# EAGLE schematic PCB (EAGLE 9.2.0)
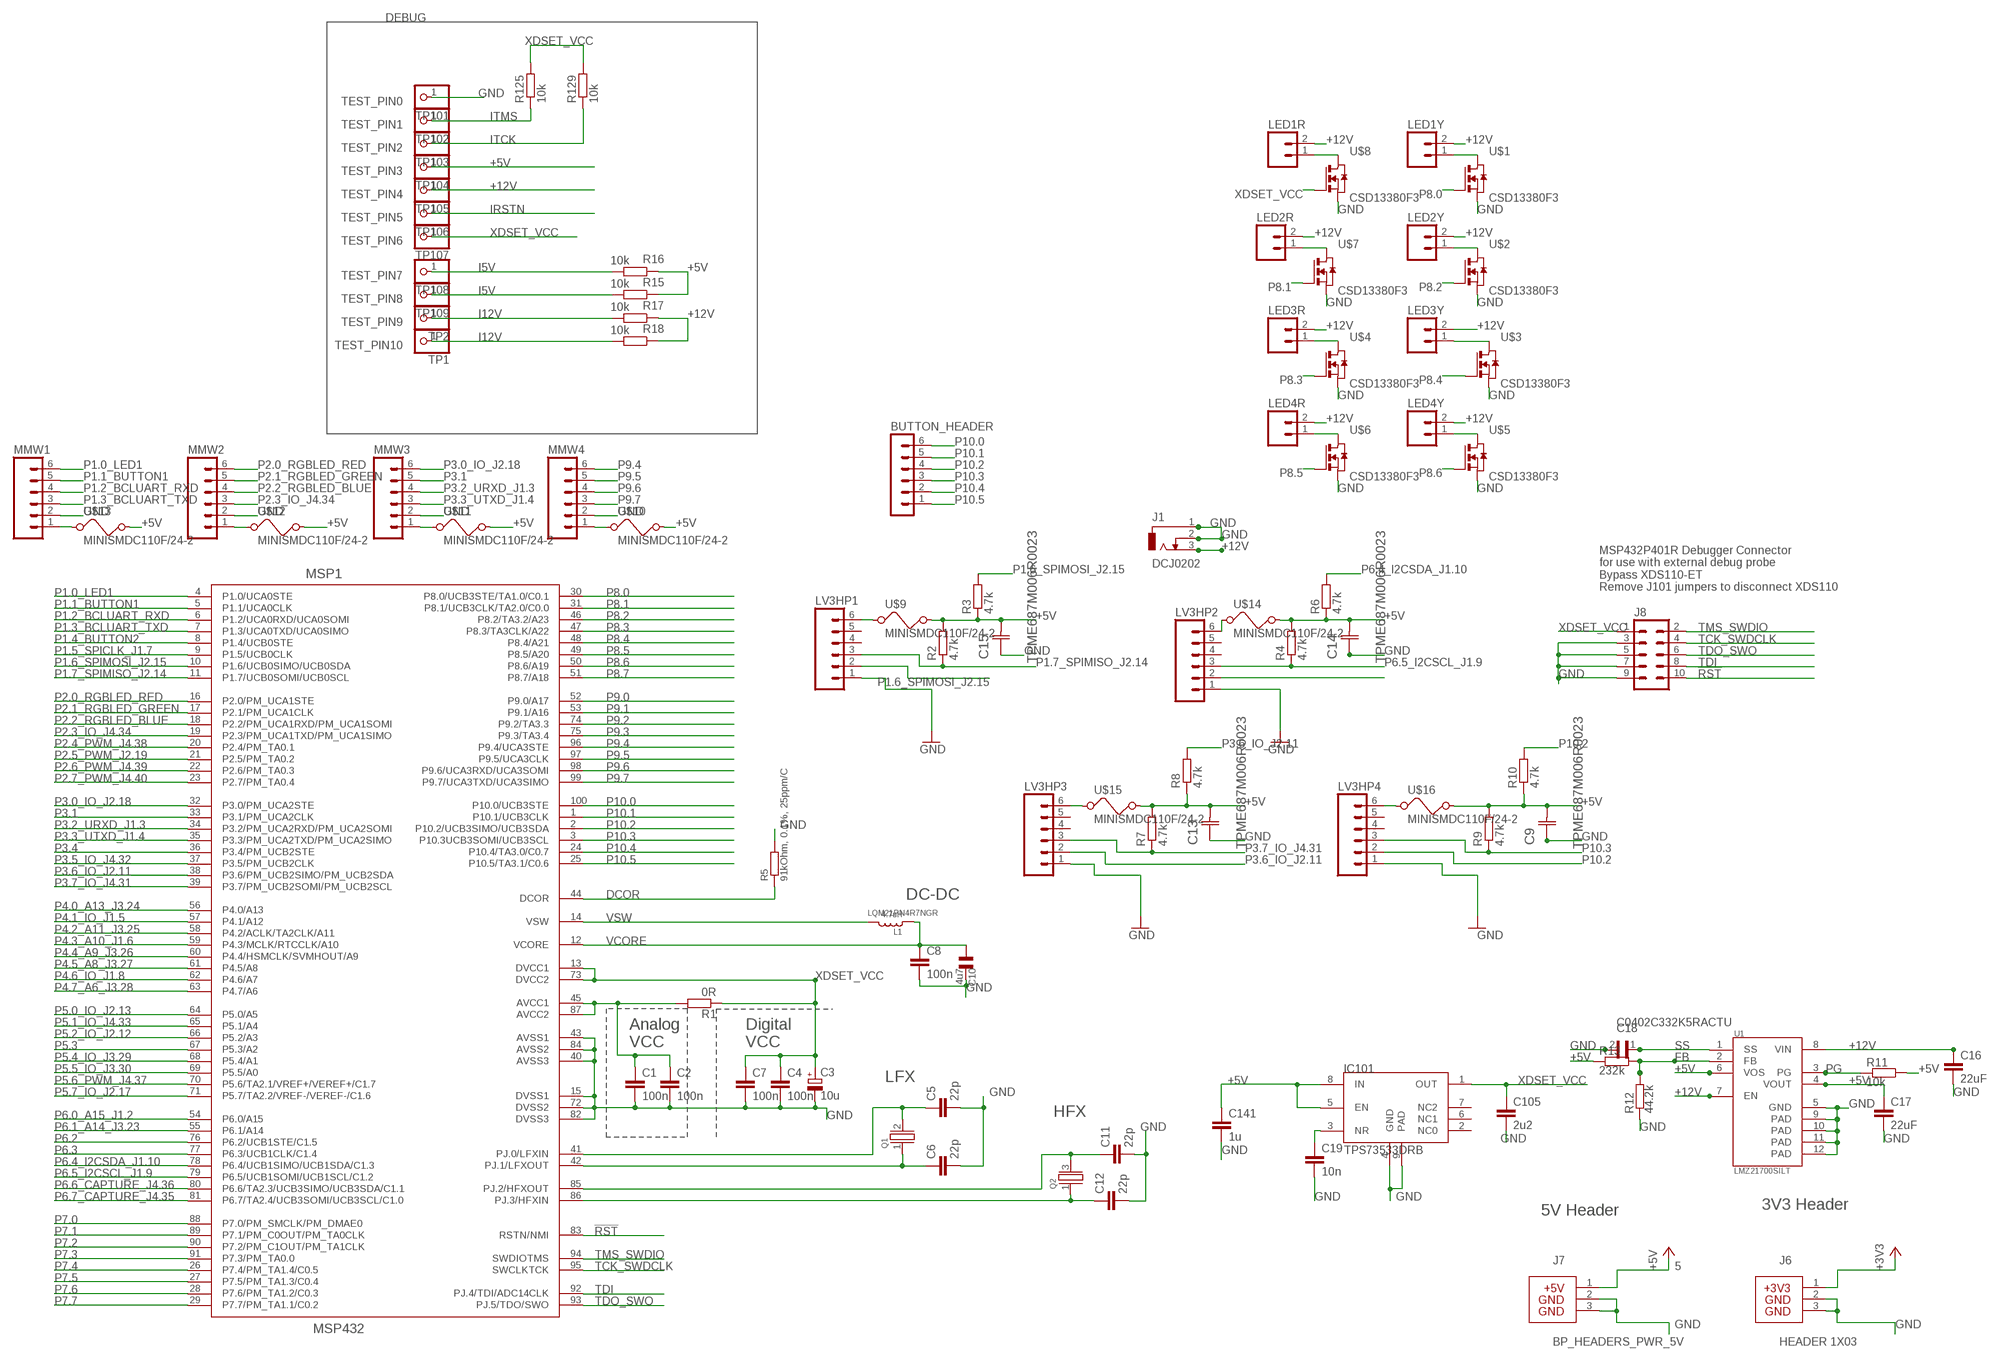
[diagram p0: schematic, sheet 1]

## Parts
BUTTON_HEADER  MA06-1  [MA06-1]
C1  100n  C-EUCM0402  [0402]
C2  100n  C-EUCM0402  [0402]
C3  10u  CPOL-EUA/3216-18R  [A/3216-18R]
C4  100n  C-EUCM0402  [0402]
C5  22p  C-EUCM0402  [0402]
C6  22p  C-EUCM0402  [0402]
C7  100n  C-EUCM0402  [0402]
C8  100n  C-EUCM0402  [0402]
C9  TPME687M006R0023  [CAPCP7343X430N]
C10  4u7  CSMD0805  [CSMD0805]
C11  22p  C-EUCM0402  [0402]
C12  22p  C-EUCM0402  [0402]
C13  TPME687M006R0023  [CAPCP7343X430N]
C14  TPME687M006R0023  [CAPCP7343X430N]
C15  TPME687M006R0023  [CAPCP7343X430N]
C16  22uF  22UF-0805-6.3V-20%  [0805]
C17  22uF  22UF-0805-6.3V-20%  [0805]
C18  C0402C332K5RACTU  [CAPC1005X55N]
C19  10n  C-EUC0603  [C0603]
C105  2u2  C-EUC0603  [C0603]
C141  1u  C-EUC0603  [C0603]
IC101  TPS73533DRB  TPS73633DRB  [SON8]
J1  DCJ0202  [DCJ0202]
J6  HEADER 1X03  BP_HEADERS_PWR_3V3100-TH  [3PIN_PWR_3V3]
J7  BP_HEADERS_PWR_5V  [3PIN_PWR_5V]
J8  DEBUG_ARM-10  [ARM-10]
L1  4.7uH  LQM2MP_G0  [0806]
LED1R  MA02  [02PA]
LED1Y  MA02  [02PA]
LED2R  MA02  [02PA]
LED2Y  MA02  [02PA]
LED3R  MA02  [02PA]
LED3Y  MA02  [02PA]
LED4R  MA02  [02PA]
LED4Y  MA02  [02PA]
LV3HP1  MA06  [06PA]
LV3HP2  MA06  [06PA]
LV3HP3  MA06  [06PA]
LV3HP4  MA06  [06PA]
MMW1  MA06  [06PA]
MMW2  MA06  [06PA]
MMW3  MA06  [06PA]
MMW4  MA06  [06PA]
MSP1  MSP432  [PZ100]
Q1  CRYSTALLF_GENERAL  [LF_XTAL]
Q2  CRYSTALEPSON_FA-238  [FA-238]
R1  0R  R-EU_RM0402  [0402]
R2  4.7k  R-EU_RM0402  [0402]
R3  4.7k  R-EU_RM0402  [0402]
R4  4.7k  R-EU_RM0402  [0402]
R5  91kOhm, 0.1%, 25ppm/C  R_0805  [0805]
R6  4.7k  R-EU_RM0402  [0402]
R7  4.7k  R-EU_RM0402  [0402]
R8  4.7k  R-EU_RM0402  [0402]
R9  4.7k  R-EU_RM0402  [0402]
R10  4.7k  R-EU_RM0402  [0402]
R11  10k  SMK  [SMK]
R12  44.2k  SMK  [SMK]
R13  232k  SMK  [SMK]
R15  10k  R-EU_RM0402  [0402]
R16  10k  R-EU_RM0402  [0402]
R17  10k  R-EU_RM0402  [0402]
R18  10k  R-EU_RM0402  [0402]
R125  10k  R-EU_RM0402  [0402]
R129  10k  R-EU_RM0402  [0402]
TP1  TEST_PIN10  PINHD-1X1  [1X01]
TP2  TEST_PIN9  PINHD-1X1  [1X01]
TP101  TEST_PIN0  PINHD-1X1  [1X01]
TP102  TEST_PIN1  PINHD-1X1  [1X01]
TP103  TEST_PIN2  PINHD-1X1  [1X01]
TP104  TEST_PIN3  PINHD-1X1  [1X01]
TP105  TEST_PIN4  PINHD-1X1  [1X01]
TP106  TEST_PIN5  PINHD-1X1  [1X01]
TP107  TEST_PIN6  PINHD-1X1  [1X01]
TP108  TEST_PIN7  PINHD-1X1  [1X01]
TP109  TEST_PIN8  PINHD-1X1  [1X01]
U1  LMZ21700SILT  [DFN350X350X175-10RN]
U$1  CSD13380F3  [FEMTO-LGA]
U$2  CSD13380F3  [FEMTO-LGA]
U$3  CSD13380F3  [FEMTO-LGA]
U$4  CSD13380F3  [FEMTO-LGA]
U$5  CSD13380F3  [FEMTO-LGA]
U$6  CSD13380F3  [FEMTO-LGA]
U$7  CSD13380F3  [FEMTO-LGA]
U$8  CSD13380F3  [FEMTO-LGA]
U$9  MINISMDC110F/24-2  [MINISMDC110]
U$10  MINISMDC110F/24-2  [MINISMDC110]
U$11  MINISMDC110F/24-2  [MINISMDC110]
U$12  MINISMDC110F/24-2  [MINISMDC110]
U$13  MINISMDC110F/24-2  [MINISMDC110]
U$14  MINISMDC110F/24-2  [MINISMDC110]
U$15  MINISMDC110F/24-2  [MINISMDC110]
U$16  MINISMDC110F/24-2  [MINISMDC110]

## Nets
5: J7.1 ; supply symbol labelled +5V
!RST: J8.10 MSP1.83(RSTN/NMI)
+3V3: J6.1
+5V: C9.2(C2) C13.2(C2) C14.2(C2) C15.2(C2) C17.1 C141.1 IC101.5(EN) IC101.8(IN) R2.2 R3.1 R4.2 R6.1 R7.2 R8.1 R9.2 R10.1 R11.1 R13.2 R15.1 R16.1 TP104.1 U1.4(VOUT) U1.6(VOS) U$9.P$2 U$10.P$2 U$11.P$2 U$12.P$2 U$13.P$2 U$14.P$2 U$15.P$2 U$16.P$2
+12V: C16.1 J1.3 LED1R.2 LED1Y.2 LED2R.2 LED2Y.2 LED3R.2 LED3Y.2 LED4R.2 LED4Y.2 R17.1 R18.1 TP105.1 U1.7(EN) U1.8(VIN)
DCOR: MSP1.44(DCOR) R5.1
FB: R12.1 R13.1 U1.2(FB)
GND: C1.2 C2.2 C3.- C4.2 C5.2 C6.2 C7.2 C8.2 C9.1(C1) C10.2 C11.2 C12.2 C13.1(C1) C14.1(C1) C15.1(C1) C16.2 C17.2 C18.2 C19.2 C105.2 C141.2 IC101.4(GND) IC101.9(PAD) J1.1 J1.2 J6.2 J6.3 J7.2 J7.3 J8.3 J8.5 J8.7 J8.9 LED1R.1 LED1Y.1 LED2R.1 LED2Y.1 LED3R.1 LED3Y.1 LED4Y.1 LV3HP1.1 LV3HP2.1 LV3HP3.1 LV3HP4.1 MMW1.2 MMW2.2 MMW3.2 MMW4.2 MSP1.15(DVSS1) MSP1.40(AVSS3) MSP1.43(AVSS1) MSP1.72(DVSS2) MSP1.82(DVSS3) MSP1.84(AVSS2) R5.2 R12.2 TP101.1 U$1.DRAIN(D) U$1.SOURCE(S) U$2.DRAIN(D) U$2.SOURCE(S) U$3.DRAIN(D) U$3.SOURCE(S) U$4.DRAIN(D) U$4.SOURCE(S) U$5.DRAIN(D) U$5.SOURCE(S) U$6.SOURCE(S) U$7.DRAIN(D) U$7.SOURCE(S) U$8.DRAIN(D) U$8.SOURCE(S)
I5V: R15.2 R16.2 TP108.1 TP109.1
I12V: R17.2 R18.2 TP1.1 TP2.1
IRSTN: TP106.1
ITCK: R129.1 TP103.1
ITMS: R125.1 TP102.1
N$1: LED4R.1 U$6.DRAIN(D)
N$3: LV3HP1.6 U$9.P$1
N$4: LV3HP2.6 U$14.P$1
N$5: LV3HP4.6 U$16.P$1
N$6: C1.1 C2.1 MSP1.45(AVCC1) MSP1.87(AVCC2) R1.2
N$7: LV3HP3.6 U$15.P$1
N$8: MMW1.1 U$13.P$1
N$9: MMW2.1 U$12.P$1
N$10: U1.5(GND) U1.9(PAD) U1.10(PAD) U1.11(PAD) U1.12(PAD)
N$11: C19.1 IC101.3(NR)
N$12: MMW3.1 U$11.P$1
N$14: LV3HP2.2
N$15: MMW4.1 U$10.P$1
N$34: C6.1 MSP1.42(PJ.1/LFXOUT) Q1.1
N$38: C5.1 MSP1.41(PJ.0/LFXIN) Q1.2
P1.0_LED1: MMW1.6 MSP1.4(P1.0/UCA0STE)
P1.1_BUTTON1: MMW1.5 MSP1.5(P1.1/UCA0CLK)
P1.2_BCLUART_RXD: MMW1.4 MSP1.6(P1.2/UCA0RXD/UCA0SOMI)
P1.3_BCLUART_TXD: MMW1.3 MSP1.7(P1.3/UCA0TXD/UCA0SIMO)
P1.4_BUTTON2: MSP1.8(P1.4/UCB0STE)
P1.5_SPICLK_J1.7: MSP1.9(P1.5/UCB0CLK)
P1.6_SPIMOSI_J2.15: LV3HP1.2 MSP1.10(P1.6/UCB0SIMO/UCB0SDA) R3.2
P1.7_SPIMISO_J2.14: LV3HP1.3 MSP1.11(P1.7/UCB0SOMI/UCB0SCL) R2.1
P2.0_RGBLED_RED: MMW2.6 MSP1.16(P2.0/PM_UCA1STE)
P2.1_RGBLED_GREEN: MMW2.5 MSP1.17(P2.1/PM_UCA1CLK)
P2.2_RGBLED_BLUE: MMW2.4 MSP1.18(P2.2/PM_UCA1RXD/PM_UCA1SOMI)
P2.3_IO_J4.34: MMW2.3 MSP1.19(P2.3/PM_UCA1TXD/PM_UCA1SIMO)
P2.4_PWM_J4.38: MSP1.20(P2.4/PM_TA0.1)
P2.5_PWM_J2.19: MSP1.21(P2.5/PM_TA0.2)
P2.6_PWM_J4.39: MSP1.22(P2.6/PM_TA0.3)
P2.7_PWM_J4.40: MSP1.23(P2.7/PM_TA0.4)
P3.0_IO_J2.18: MMW3.6 MSP1.32(P3.0/PM_UCA2STE)
P3.1: MMW3.5 MSP1.33(P3.1/PM_UCA2CLK)
P3.2_URXD_J1.3: MMW3.4 MSP1.34(P3.2/PM_UCA2RXD/PM_UCA2SOMI)
P3.3_UTXD_J1.4: MMW3.3 MSP1.35(P3.3/PM_UCA2TXD/PM_UCA2SIMO)
P3.4: MSP1.36(P3.4/PM_UCB2STE)
P3.5_IO_J4.32: MSP1.37(P3.5/PM_UCB2CLK)
P3.6_IO_J2.11: LV3HP3.2 MSP1.38(P3.6/PM_UCB2SIMO/PM_UCB2SDA) R8.2
P3.7_IO_J4.31: LV3HP3.3 MSP1.39(P3.7/PM_UCB2SOMI/PM_UCB2SCL) R7.1
P4.0_A13_J3.24: MSP1.56(P4.0/A13)
P4.1_IO_J1.5: MSP1.57(P4.1/A12)
P4.2_A11_J3.25: MSP1.58(P4.2/ACLK/TA2CLK/A11)
P4.3_A10_J1.6: MSP1.59(P4.3/MCLK/RTCCLK/A10)
P4.4_A9_J3.26: MSP1.60(P4.4/HSMCLK/SVMHOUT/A9)
P4.5_A8_J3.27: MSP1.61(P4.5/A8)
P4.6_IO_J1.8: MSP1.62(P4.6/A7)
P4.7_A6_J3.28: MSP1.63(P4.7/A6)
P5.0_IO_J2.13: MSP1.64(P5.0/A5)
P5.1_IO_J4.33: MSP1.65(P5.1/A4)
P5.2/XT2IN: C12.1 MSP1.86(PJ.3/HFXIN) Q2.1
P5.2_IO_J2.12: MSP1.66(P5.2/A3)
P5.3: MSP1.67(P5.3/A2)
P5.3/XT2OUT: C11.1 MSP1.85(PJ.2/HFXOUT) Q2.3
P5.4_IO_J3.29: MSP1.68(P5.4/A1)
P5.5_IO_J3.30: MSP1.69(P5.5/A0)
P5.6_PWM_J4.37: MSP1.70(P5.6/TA2.1/VREF+/VEREF+/C1.7)
P5.7_IO_J2.17: MSP1.71(P5.7/TA2.2/VREF-/VEREF-/C1.6)
P6.0_A15_J1.2: MSP1.54(P6.0/A15)
P6.1_A14_J3.23: MSP1.55(P6.1/A14)
P6.2: MSP1.76(P6.2/UCB1STE/C1.5)
P6.3: MSP1.77(P6.3/UCB1CLK/C1.4)
P6.4_I2CSDA_J1.10: MSP1.78(P6.4/UCB1SIMO/UCB1SDA/C1.3) R6.2
P6.5_I2CSCL_J1.9: LV3HP2.3 MSP1.79(P6.5/UCB1SOMI/UCB1SCL/C1.2) R4.1
P6.6_CAPTURE_J4.36: MSP1.80(P6.6/TA2.3/UCB3SIMO/UCB3SDA/C1.1)
P6.7_CAPTURE_J4.35: MSP1.81(P6.7/TA2.4/UCB3SOMI/UCB3SCL/C1.0)
P7.0: MSP1.88(P7.0/PM_SMCLK/PM_DMAE0)
P7.1: MSP1.89(P7.1/PM_C0OUT/PM_TA0CLK)
P7.2: MSP1.90(P7.2/PM_C1OUT/PM_TA1CLK)
P7.3: MSP1.91(P7.3/PM_TA0.0)
P7.4: MSP1.26(P7.4/PM_TA1.4/C0.5)
P7.5: MSP1.27(P7.5/PM_TA1.3/C0.4)
P7.6: MSP1.28(P7.6/PM_TA1.2/C0.3)
P7.7: MSP1.29(P7.7/PM_TA1.1/C0.2)
P8.0: MSP1.30(P8.0/UCB3STE/TA1.0/C0.1) U$1.GATE(G)
P8.1: MSP1.31(P8.1/UCB3CLK/TA2.0/C0.0) U$7.GATE(G)
P8.2: MSP1.46(P8.2/TA3.2/A23) U$2.GATE(G)
P8.3: MSP1.47(P8.3/TA3CLK/A22) U$4.GATE(G)
P8.4: MSP1.48(P8.4/A21) U$3.GATE(G)
P8.5: MSP1.49(P8.5/A20) U$6.GATE(G)
P8.6: MSP1.50(P8.6/A19) U$5.GATE(G)
P8.7: MSP1.51(P8.7/A18)
P9.0: MSP1.52(P9.0/A17)
P9.1: MSP1.53(P9.1/A16)
P9.2: MSP1.74(P9.2/TA3.3)
P9.3: MSP1.75(P9.3/TA3.4)
P9.4: MMW4.6 MSP1.96(P9.4/UCA3STE)
P9.5: MMW4.5 MSP1.97(P9.5/UCA3CLK)
P9.6: MMW4.4 MSP1.98(P9.6/UCA3RXD/UCA3SOMI)
P9.7: MMW4.3 MSP1.99(P9.7/UCA3TXD/UCA3SIMO)
P10.0: BUTTON_HEADER.6 MSP1.100(P10.0/UCB3STE)
P10.1: BUTTON_HEADER.5 MSP1.1(P10.1/UCB3CLK)
P10.2: BUTTON_HEADER.4 LV3HP4.2 MSP1.2(P10.2/UCB3SIMO/UCB3SDA) R10.2
P10.3: BUTTON_HEADER.3 LV3HP4.3 MSP1.3(P10.3UCB3SOMI/UCB3SCL) R9.1
P10.4: BUTTON_HEADER.2 MSP1.24(P10.4/TA3.0/C0.7)
P10.5: BUTTON_HEADER.1 MSP1.25(P10.5/TA3.1/C0.6)
PG: R11.2 U1.3(PG)
SS: C18.1 U1.1(SS)
TCK_SWDCLK: J8.4 MSP1.95(SWCLKTCK)
TDI: J8.8 MSP1.92(PJ.4/TDI/ADC14CLK)
TDO_SWO: J8.6 MSP1.93(PJ.5/TDO/SWO)
TMS_SWDIO: J8.2 MSP1.94(SWDIOTMS)
VCORE: C8.1 C10.1 L1.1 MSP1.12(VCORE)
VSW: L1.2 MSP1.14(VSW)
XDSET_VCC: C3.+ C4.1 C7.1 C105.1 IC101.1(OUT) J8.1 MSP1.13(DVCC1) MSP1.73(DVCC2) R1.1 R125.2 R129.2 TP107.1 U$8.GATE(G)
Unconnected: IC101.2(NC0) IC101.6(NC1) IC101.7(NC2) LV3HP1.4 LV3HP1.5 LV3HP2.4 LV3HP2.5 LV3HP3.4 LV3HP3.5 LV3HP4.4 LV3HP4.5

## Notes on the sheet
- DEBUG
- MSP432P401R Debugger Connector
  for use with external debug probe
  Bypass XDS110-ET
  Remove J101 jumpers to disconnect XDS110
- DC-DC
- LQM21PN4R7NGR
- Analog | Digital
- VCC | VCC
- LFX
- HFX
- 3V3 Header
- 5V Header

## Library data of the parts
BUTTON_HEADER = con-lstb:MA06-1: PIN HEADER; OC_FARNELL: unknown; OC_NEWARK: unknown
C1 C2 C4-C8 C11 C12 C19 C105 C141 = rcl:C-EU: CAPACITOR, European symbol
C3 = rcl:CPOL-EU: POLARIZED CAPACITOR, European symbol
C9 C13-C15 = TPME687M006R0023:TPME687M006R0023: Tantalum Capacitor , 2917; AVAILABILITY: Unavailable; DESCRIPTION: Cap Tant Solid 680uF 6.3V E CASE 20% _7.3 X 4.3 X 4.1mm_ SMD 7343-43 0.023 Ohm 125°C T/R; MF: AVX; MP: TPME687M006R0023; PACKAGE: 2917 AVX; PRICE: None
C10 = cap:CSMD0805
C16 C17 = SparkFun-Capacitors:22UF: 22µF ceramic capacitors A capacitor is a passive two-terminal electrical component used to store electrical energy temporarily in an electric field.; PROD_ID: CAP-08402
C18 = C0402C332K5RACTU:C0402C332K5RACTU: CAPACITOR MLCC, 3300PF, 50V, 10%, 0402; Product Range:KEMET - C Series; Capacitance:3300pF; Capacitance Tolerance:± 10%; Dielectric Characteristic:X7R; Voltage Rating:50V; Capacitor Case Style:0402 [1005 Metric]; Operating ;RoHS Compliant: Yes; AVAILABILITY: Unavailable; DESCRIPTION: Capacitor; Ceramic; Cap; 3300pf ; Tol+10%; Smd; Vol-Rtg 50v; X7r; MF: KEMET; MP: C0402C332K5RACTU; PACKAGE: 0402 KEMET; PRICE: None
IC101 = MSP430G6_LP:TPS73633DRB
J1 = con-jack:DCJ0202: DC POWER JACK Source: DCJ0202.pdf; OC_FARNELL: unknown; OC_NEWARK: unknown
J6 = LaunchPad_Template_Library:BP_HEADERS_PWR_3V3; CCO: 258-0001299; DESCRIPTION: CONN HEADER .100 SINGL STR 3POS; MAN: SULLINS
J7 = LaunchPad_Template_Library:BP_HEADERS_PWR_5V
J8 = MSP430_Headers:DEBUG_ARM-10; SAMTEC: FTSH-105-01-F-D-K
L1 = Murata:LQM2MP_G0
LED1R LED1Y LED2R LED2Y LED3R LED3Y LED4R LED4Y = con-amp-quick:MA02: AMP QUICK CONNECTOR; OC_FARNELL: unknown; OC_NEWARK: unknown
LV3HP1-LV3HP4 MMW1-MMW4 = con-amp-quick:MA06: AMP QUICK CONNECTOR; OC_FARNELL: unknown; OC_NEWARK: unknown
MSP1 = MSP-EXP432:MSP432
Q1 Q2 = MSP_Crystals:CRYSTAL
R1-R4 R6-R10 R15-R18 R125 R129 = rcl:R-EU_: RESISTOR, European symbol
R5 = smd:R_0805
R11-R13 = resistor-shunt:SMK: SMD SHUNT RESISTOR; OC_FARNELL: unknown; OC_NEWARK: unknown
TP1 TP2 TP101-TP109 = pinhead:PINHD-1X1: PIN HEADER
U1 = LMZ21700SILT:LMZ21700SILT: 650mA SIMPLE SWITCHER? Nano Module with 17V Maximum Input Voltage 8-uSiP -40 to 125; AVAILABILITY: Unavailable; DESCRIPTION: 650mA SIMPLE SWITCHER? Nano Module with 17V Maximum Input Voltage 8-uSiP -40 to 125; MF: Texas Instruments; MP: LMZ21700SILT; PACKAGE: SMD-8 Texas Instruments; PRICE: None
U$1-U$8 = CSD13380F3:CSD13380F3; AVAILABILITY: Unavailable; DESCRIPTION: 12V N-Channel FemtoFET™ MOSFET 3-PICOSTAR -55 to 150; MF: Texas Instruments; MP: CSD13380F3; PACKAGE: XFDFN-3 Texas Instruments; PRICE: None
U$9-U$16 = MINISMDC110F_24-2:MINISMDC110F/24-2; AVAILABILITY: Unavailable; DESCRIPTION: PTC Resettable Fuse 1.1A_hold_ 2.2A_trip_ 24V 20A 0.8W 0.06Ohm SMD Solder Pad 1812 T/R Automotive; MF: Littelfuse Inc.; MP: MINISMDC110F/24-2; PACKAGE: 1812 Littelfuse; PRICE: None

## Net classes
0 default: width 0.254 mm
2 Power: width 0.203 mm, drill 0.305 mm, clearance 0.152 mm to class 0, clearance 0.152 mm to class 1, clearance 0.152 mm